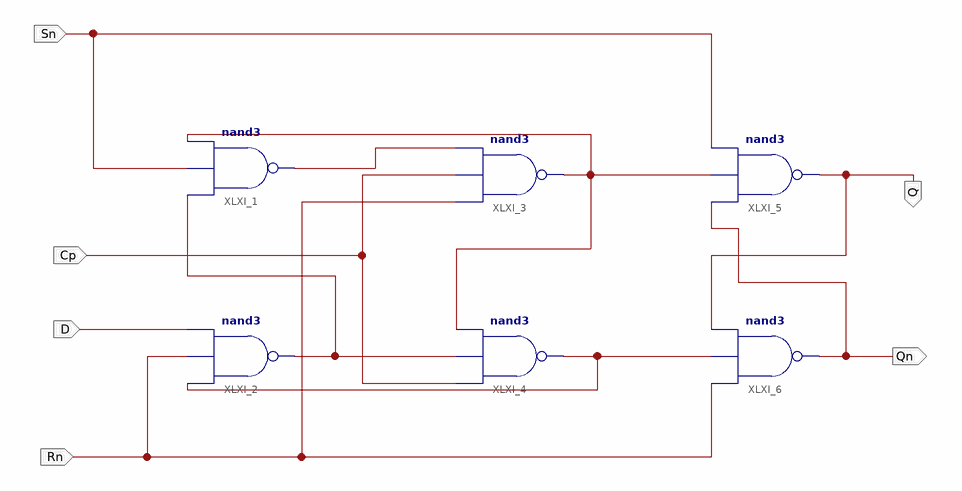
[diagram p0: schematic sheet 1]
// Xilinx ISE schematic MB_DFF.sch (kintex7) as structural Verilog: 6 symbols, 6 ports
module MB_DFF (
  input  Sn,
  input  Cp,
  input  Rn,
  input  D,
  output Q,
  output Qn
);

  wire XLXN_1, XLXN_6, XLXN_10, XLXN_11;

  nand XLXI_1 (XLXN_6, XLXN_10, Sn, XLXN_1);
  nand XLXI_2 (XLXN_10, XLXN_11, Rn, D);
  nand XLXI_3 (XLXN_1, Rn, Cp, XLXN_6);
  nand XLXI_4 (XLXN_11, Cp, XLXN_10, XLXN_1);
  nand XLXI_5 (Q, Qn, XLXN_1, Sn);
  nand XLXI_6 (Qn, Rn, XLXN_11, Q);
endmodule
